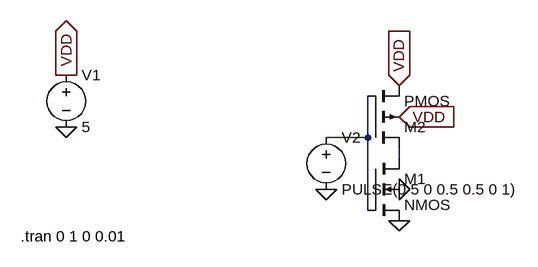
[diagram p0: schematic cmos_inverter.asc]
cmos_inverter.asc, the LTspice schematic file:
Version 4
SHEET 1 880 680
WIRE 112 160 112 96
WIRE 112 160 48 160
WIRE 160 192 160 176
WIRE 112 272 112 160
FLAG 160 288 0
FLAG 160 80 VDD
IOPIN 160 80 In
FLAG -352 64 VDD
IOPIN -352 64 Out
FLAG -352 144 0
FLAG 48 240 0
FLAG 160 128 VDD
IOPIN 160 128 In
FLAG 160 240 0
SYMBOL nmos4 112 192 R0
SYMATTR InstName M1
SYMATTR Value2 l=1u w=2u
SYMBOL pmos4 112 176 M180
SYMATTR InstName M2
SYMATTR Value2 l=1u w=5u
SYMBOL voltage -352 48 R0
WINDOW 123 0 0 Left 0
WINDOW 39 0 0 Left 0
SYMATTR InstName V1
SYMATTR Value 5
SYMBOL voltage 48 144 R0
WINDOW 123 0 0 Left 0
WINDOW 39 0 0 Left 0
SYMATTR InstName V2
SYMATTR Value PULSE(0 5 0 0.5 0.5 0 1)
TEXT -422 312 Left 2 !.tran 0 1 0 0.01

The netlist it stands for:
* cmos_inverter.asc
M1 N002 N001 0 0 NMOS l=1u w=2u
M2 N002 N001 VDD VDD PMOS l=1u w=5u
V1 VDD 0 5
V2 N001 0 PULSE(0 5 0 0.5 0.5 0 1)
.model NMOS NMOS
.model PMOS PMOS
.lib standard.mos
.tran 0 1 0 0.01
.backanno
.end